# EAGLE design SolarMonitorDisplayBoard (EAGLE 7.5.0)
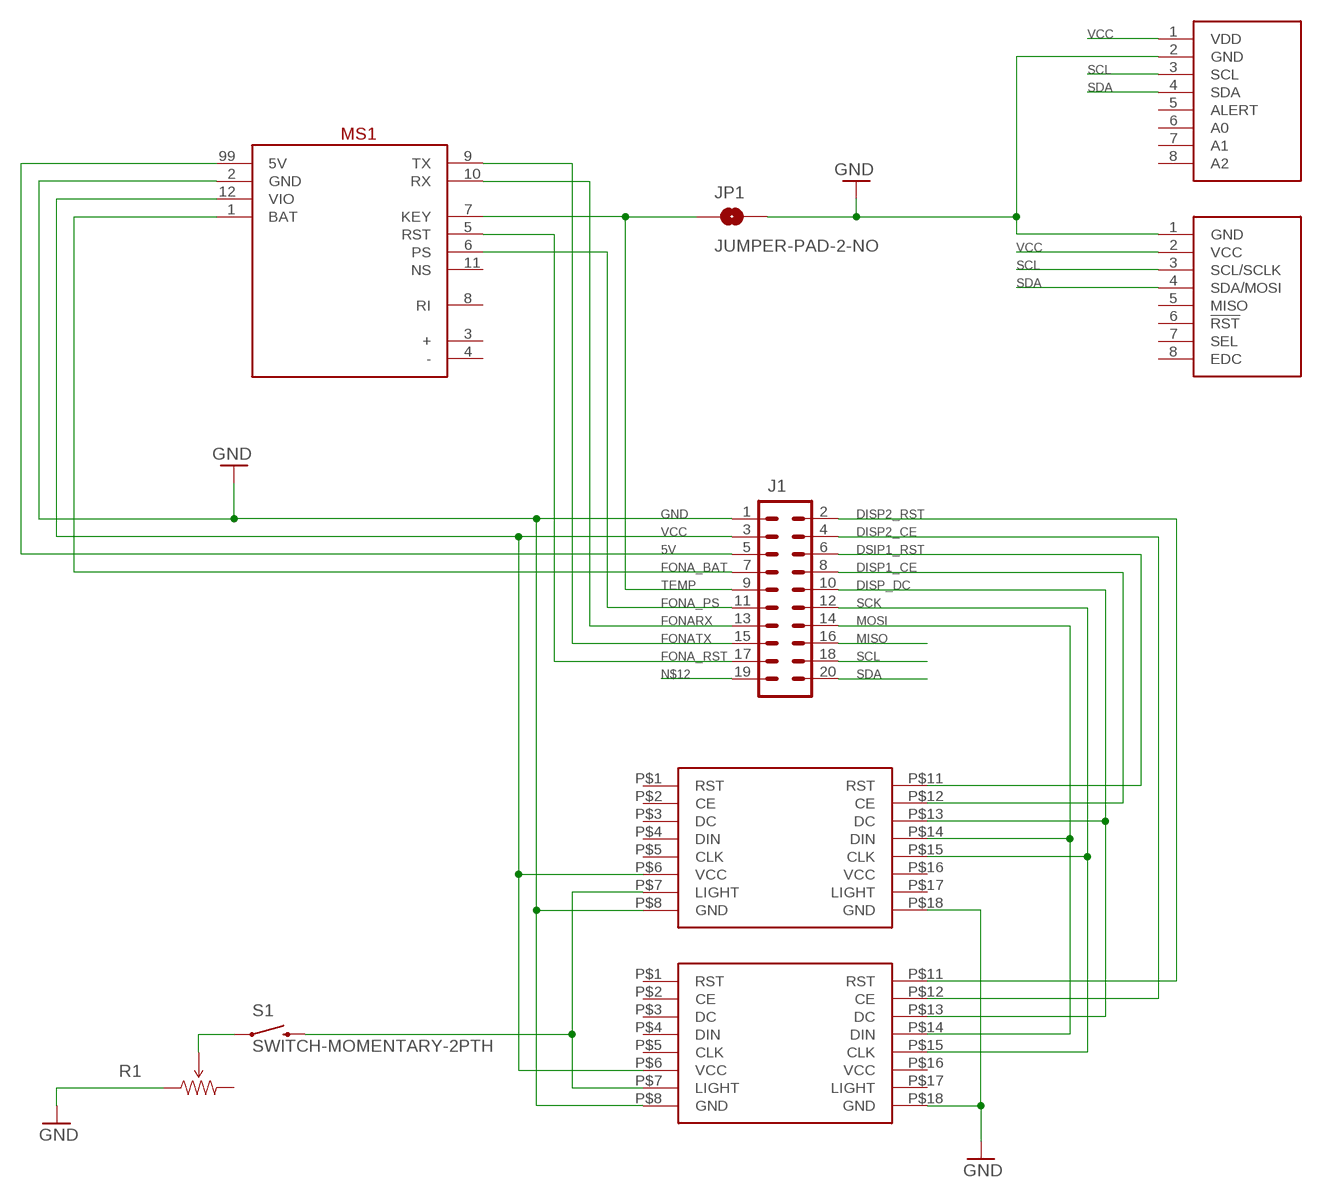
[diagram p0: schematic, sheet 1]

## Parts
BARO  T5403_BREAKOUT  [T5403_BREAKOUT]
J1  M10X2  [2X10]
JP1  JUMPER-PAD-2-NO  [PAD-JUMPER-2-NO_NO_SILK]
MS1  FONA  [FONA]
R1  TRIMPOTPTH  [TRIM_POT_PTH]
S1  SWITCH-MOMENTARY-2PTH  [TACTILE-PTH]
TEMP  MCP9808_BREAKOUT  [MCP9808_BREAKOUT]
U$1  NOKIA_LCD_BREAKOUT  [NOKIA_LCD_BREAKOUT]
U$2  NOKIA_LCD_BREAKOUT  [NOKIA_LCD_BREAKOUT]

## Nets
5V: J1.5 MS1.99(5V)
DISP1_CE: J1.8 U$2.P$12(CE)
DISP2_CE: J1.4 U$1.P$12(CE)
DISP2_RST: J1.2 U$1.P$11(RST)
DISP_DC: J1.10 U$1.P$13(DC) U$2.P$13(DC)
DSIP1_RST: J1.6 U$2.P$11(RST)
FONA_BAT: J1.7 MS1.1(BAT)
FONA_PS: J1.11 MS1.6(PS)
FONA_RST: J1.17 MS1.5(RST)
FONARX: J1.13 MS1.10(RX)
FONATX: J1.15 MS1.9(TX)
GND: BARO.1(GND) J1.1 JP1.2 MS1.2(GND) R1.1(CCW) TEMP.2(GND) U$1.P$8(GND) U$1.P$18(GND) U$2.P$8(GND) U$2.P$18(GND)
MISO: J1.16
MOSI: J1.14 U$1.P$14(DIN) U$2.P$14(DIN)
N$1: R1.2(WIPER) S1.1
N$2: S1.3 U$1.P$7(LIGHT) U$2.P$7(LIGHT)
N$12: J1.19
SCK: J1.12 U$1.P$15(CLK) U$2.P$15(CLK)
SCL: BARO.3(SCL/SCLK) J1.18 TEMP.3(SCL)
SDA: BARO.4(SDA/MOSI) J1.20 TEMP.4(SDA)
TEMP: J1.9 JP1.1 MS1.7(KEY)
VCC: BARO.2(VCC) J1.3 MS1.12(VIO) TEMP.1(VDD) U$1.P$6(VCC) U$2.P$6(VCC)
Unconnected: BARO.5(MISO) BARO.6(!RST) BARO.7(SEL) BARO.8(EDC) MS1.3(+) MS1.4(-) MS1.8(RI) MS1.11(NS) R1.3(CW) TEMP.5(ALERT) TEMP.6(A0) TEMP.7(A1) TEMP.8(A2) U$1.P$1(RST) U$1.P$2(CE) U$1.P$3(DC) U$1.P$4(DIN) U$1.P$5(CLK) U$1.P$16(VCC) U$1.P$17(LIGHT) U$2.P$1(RST) U$2.P$2(CE) U$2.P$3(DC) U$2.P$4(DIN) U$2.P$5(CLK) U$2.P$16(VCC) U$2.P$17(LIGHT)

## Library data of the parts
BARO = BtParts:T5403_BREAKOUT
J1 = SparkFun-Connectors:M10X2: This was SPECIALLY designed to be used with our Graphic LCD Backpack. Be sure you want to use this! It is not only staggered on each line of header holes, but IT IS ALSO offset of the center point of the top and bottom lines by 5 mil. This causes the headers to lock into place on the "standard" footprint on the LCD screen. The extra squares on the tdocu layer are there simply to reference other pins (if you were to actually populate a longer header than ten long - this is what we do with the backpacks).
JP1 = SparkFun-Passives:JUMPER-PAD-2-NO
MS1 = BtParts:FONA
R1 = SparkFun-Electromechanical:TRIMPOT: Various small potentiometers for "set-and-forget" applications
S1 = SparkFun-Electromechanical:SWITCH-MOMENTARY-2: Various NO switches- pushbuttons, reed, etc; PROD_ID: SWCH-08441
TEMP = BtParts:MCP9808_BREAKOUT
U$1 U$2 = BtParts:NOKIA_LCD_BREAKOUT

## Net classes
0 default: width 0.254 mm, drill 0.508 mm, clearance 0.305 mm

## Board
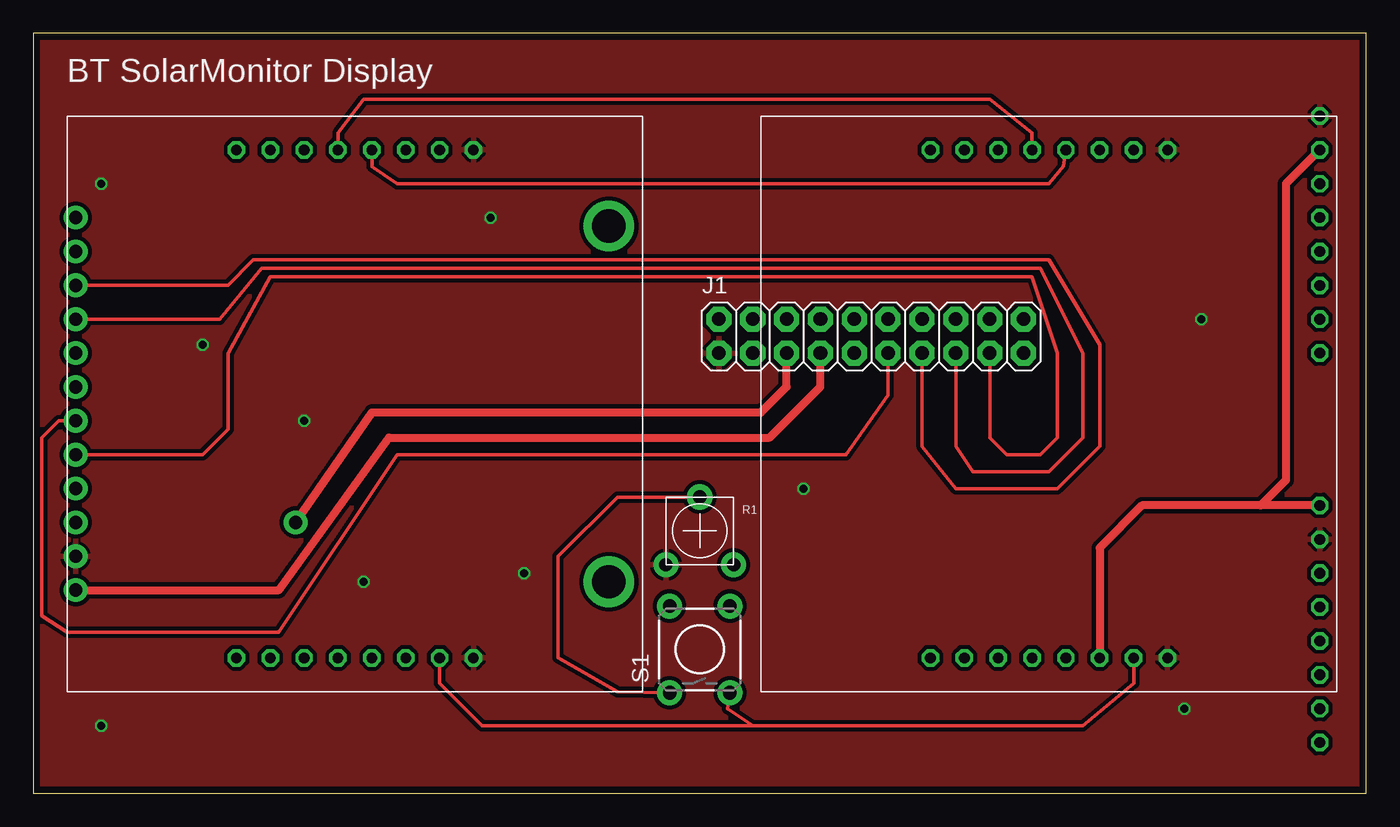
[diagram p1: board, top side]
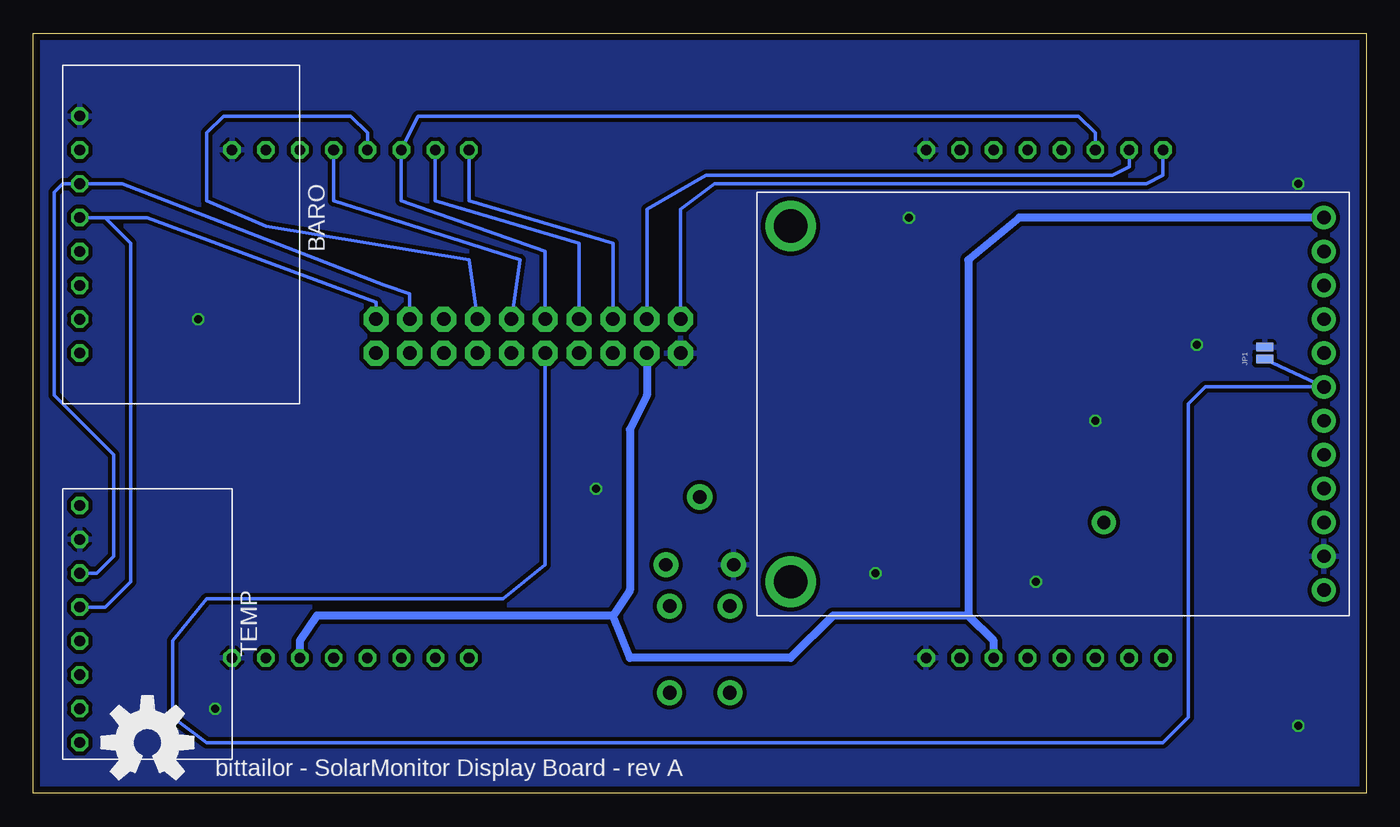
[diagram p2: board, bottom side, seen from below]

Size 100 x 57 mm. Coordinates in mm from the lower left corner, seen from the top.
Outline: 0,0 100,0 100,57 0,57 0,0
Copper layers (1*16): Top 0.035mm / dielectric 1.5mm / Bottom 0.035mm
Design rules "EagleRules_SmartProto": minimum track width 7mil, minimum drill 12mil, track to track 7mil, track to pad 7mil, pad to pad 7mil, via to via 7mil, smd to smd 0mil, copper to edge 20mil, drill to drill 10mil, minimum pad ring 10mil, minimum via ring 6mil, stop-mask expansion 2mil, vias tented up to drill 25mil, thermal gap 10mil

### Footprints (pad centres in the part's own frame; a part is rotated, then mirrored left to right if it is on the bottom)
T5403_BREAKOUT = drill 0.8 octagon: 1 3.81,1.27; 2 6.35,1.27; 3 8.89,1.27; 4 11.43,1.27; 5 13.97,1.27; 6 16.51,1.27; 7 19.05,1.27; 8 21.59,1.27
2X10 = drill 1.016 pad 1.88 octagon: 1 -11.43,-1.27; 2 -11.43,1.27; 3 -8.89,-1.27; 4 -8.89,1.27; 5 -6.35,-1.27; 6 -6.35,1.27; 7 -3.81,-1.27; 8 -3.81,1.27; 9 -1.27,-1.27; 10 -1.27,1.27; 11 1.27,-1.27; 12 1.27,1.27; 13 3.81,-1.27; 14 3.81,1.27; 15 6.35,-1.27; 16 6.35,1.27; 17 8.89,-1.27; 18 8.89,1.27; 19 11.43,-1.27; 20 11.43,1.27
PAD-JUMPER-2-NO_NO_SILK = smd 0.635 x 1.27: 1 -0.45,0; 2 0.45,0
FONA = drill 1 pad 1.778: 1 0,0; 2 2.54,0; 3 5.08,0; 4 7.62,0; 5 10.16,0; 6 12.7,0; 7 15.24,0; 8 17.78,0; 9 20.32,0; 10 22.86,0; 11 25.4,0; 12 27.94,0; 99 5.08,16.51 | drill 2.5 pad 3.81: P$1 27.305,40.005; P$2 0.635,40.005
TRIM_POT_PTH = drill 1 pad 1.88: 1 -2.54,-2.54; 2 0,2.54; 3 2.54,-2.54
TACTILE-PTH = drill 1.016 pad 1.88: 1 -3.251,2.261; 2 3.251,2.261; 3 -3.251,-2.261; 4 3.251,-2.261
MCP9808_BREAKOUT = drill 0.8 octagon: 1 1.27,1.27; 2 3.81,1.27; 3 6.35,1.27; 4 8.89,1.27; 5 11.43,1.27; 6 13.97,1.27; 7 16.51,1.27; 8 19.05,1.27
NOKIA_LCD_BREAKOUT = drill 0.8 octagon: P$1 12.7,2.54; P$2 15.24,2.54; P$3 17.78,2.54; P$4 20.32,2.54; P$5 22.86,2.54; P$6 25.4,2.54; P$7 27.94,2.54; P$8 30.48,2.54; P$11 12.7,40.64; P$12 15.24,40.64; P$13 17.78,40.64; P$14 20.32,40.64; P$15 22.86,40.64; P$16 25.4,40.64; P$17 27.94,40.64; P$18 30.48,40.64

### Placement (x,y rotation side)
BARO  97.79,54.61 270 bottom
J1  62.87,34.29 0 top
JP1  7.62,33.02 90 bottom
MS1  3.17,15.24 90 bottom
R1  50,19.68 0 top
S1  50,10.79 90 top
TEMP  97.79,22.86 270 bottom
U$1  2.54,7.62 0 top
U$2  54.61,7.62 0 top
U$3  [OSHW-LOGO-L]  91.44,3.81 0 bottom

### Tracks (layer width: path | path; a pad name or v marks a point on that pad's centre or on a via)
5V
  Top 0.61: MS1.99 25.4,28.57 54.61,28.57 56.52,30.48 J1.5
DISP1_CE
  Bottom 0.254: J1.8 59.05,41.27 69.85,44.45 U$2.P$12
DISP2_CE
  Bottom 0.254: J1.4 53.98,43.81 49.53,46.35 19.05,46.35 17.78,46.99 U$1.P$12
DISP2_RST
  Bottom 0.254: J1.2 51.44,43.81 48.9,45.72 16.51,45.72 15.24,46.35 U$1.P$11
DISP_DC
  Bottom 0.254: J1.10 61.59,40.64 72.39,44.45 U$2.P$13 71.12,50.8 21.59,50.8 20.32,49.53 U$1.P$13
DSIP1_RST
  Bottom 0.254: J1.6 56.52,41.27 67.31,44.45 U$2.P$11
FONA_BAT
  Top 0.61: MS1.1 18.41,15.24 26.67,26.67 55.24,26.67 59.05,30.48 J1.7
FONA_PS
  Top 0.254: MS1.6 1.91,27.94 0.64,26.67 0.64,13.34 2.54,12.06 18.41,12.06 27.3,25.4 60.96,25.4 64.14,29.84 J1.11
FONA_RST
  Top 0.254: MS1.5 12.7,25.4 14.61,27.3 14.61,33.02 17.78,38.73 74.93,38.73 76.83,33.02 76.83,26.67 75.56,25.4 73.03,25.4 71.75,26.67 J1.17
FONARX
  Top 0.254: MS1.10 14.61,38.1 16.51,40.01 76.2,40.01 80.01,33.66 80.01,26.04 76.83,22.86 69.22,22.86 66.67,26.04 J1.13
FONATX
  Top 0.254: MS1.9 13.97,35.56 17.14,39.37 75.56,39.37 78.74,33.02 78.74,26.67 76.2,24.13 70.48,24.13 69.22,26.04 J1.15
GND  (via drill 0.6)
  other vias: 34.29,43.18 57.78,22.86 36.83,16.51 86.36,6.35 20.32,27.94 87.63,35.56 5.08,45.72 5.08,5.08 24.77,15.88 12.7,33.66
  pour Top: 0,0 0,57.15 100.33,57.15 100.33,0
  pour Bottom: 0,57.15 0,0 100.33,0 100.33,57.15
MOSI
  Top 0.254: U$1.P$14 22.86,49.53 24.77,52.07 71.75,52.07 74.93,49.53 U$2.P$14
  Bottom 0.254: J1.14 67.31,40.01 82.55,42.55 87,44.45 87,49.53 85.72,50.8 76.2,50.8 74.93,49.53 U$2.P$14
N$1
  Top 0.254: R1.2 43.81,22.23 39.37,17.78 39.37,10.16 43.81,7.62 S1.1
N$2
  Top 0.254: U$2.P$7 82.55,8.26 78.74,5.08 53.98,5.08 | 53.98,5.08 33.66,5.08 30.48,8.26 U$1.P$7 | S1.3 52.07,6.35 53.98,5.08
SCK
  Top 0.254: U$1.P$15 25.4,46.99 27.3,45.72 76.2,45.72 77.29,47.02 U$2.P$15
  Bottom 0.254: J1.12 63.5,40.01 77.47,44.45 U$2.P$15
SCL
  Bottom 0.254: J1.18 71.75,37.47 73.66,38.1 93.34,45.72 BARO.3 97.79,45.72 98.42,45.09 98.42,29.84 93.98,25.4 93.98,17.78 95.25,16.51 TEMP.3
SDA
  Bottom 0.254: J1.20 74.3,36.83 91.44,43.18 94.61,43.18 | 94.61,43.18 BARO.4 | TEMP.4 94.61,13.97 92.71,15.88 92.71,41.27 94.61,43.18
TEMP
  Bottom 0.254: J1.9 61.59,17.14 64.77,14.61 87,14.61 89.53,11.43 89.53,5.71 87,3.81 15.24,3.81 13.34,5.71 13.34,29.21 12.06,30.48 MS1.7 JP1.1
VCC
  Top 0.61: TEMP.1 92.08,21.59 | 92.08,21.59 83.19,21.59 80.01,18.41 U$2.P$6 | BARO.2 93.98,45.72 93.98,23.5 92.08,21.59
  Bottom 0.61: U$2.P$6 80.01,11.43 78.74,13.34 56.52,13.34 | U$1.P$6 27.94,11.43 29.84,13.34 | 29.84,13.34 40.01,13.34 43.18,10.16 55.24,10.16 56.52,13.34 | MS1.12 26.04,43.18 29.84,40.01 29.84,13.34 | J1.3 53.98,29.84 55.24,27.3 55.24,15.24 56.52,13.34

### Text on the board
tPlace: BT SolarMonitor Display
bPlace: bittailor - SolarMonitor Display Board - rev A